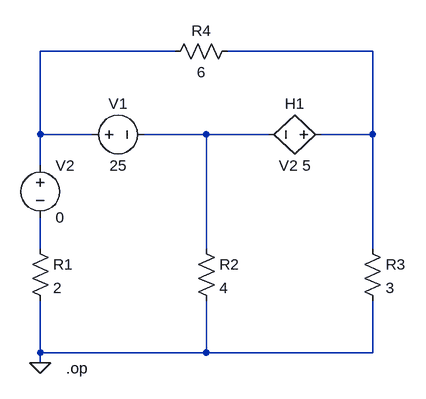
[diagram p0: schematic CH03-KP2-04.asc]
CH03-KP2-04.asc, the LTspice schematic file:
Version 4
SHEET 1 880 680
WIRE 256 48 48 48
WIRE 560 48 336 48
WIRE 48 176 48 48
WIRE 128 176 48 176
WIRE 304 176 208 176
WIRE 400 176 304 176
WIRE 560 176 560 48
WIRE 560 176 480 176
WIRE 48 224 48 176
WIRE 48 352 48 304
WIRE 304 352 304 176
WIRE 560 352 560 176
WIRE 48 512 48 432
WIRE 304 512 304 432
WIRE 304 512 48 512
WIRE 560 512 560 432
WIRE 560 512 304 512
WIRE 48 528 48 512
FLAG 48 528 0
DATAFLAG 64 176 "$"
DATAFLAG 336 176 "$"
DATAFLAG 560 176 "$"
SYMBOL res 32 336 R0
SYMATTR InstName R1
SYMATTR Value 2
SYMBOL res 288 336 R0
SYMATTR InstName R2
SYMATTR Value 4
SYMBOL res 544 336 R0
SYMATTR InstName R3
SYMATTR Value 3
SYMBOL res 352 32 R90
WINDOW 0 0 56 VBottom 2
WINDOW 3 32 56 VTop 2
SYMATTR InstName R4
SYMATTR Value 6
SYMBOL voltage 112 176 R270
WINDOW 0 32 56 VTop 2
WINDOW 3 -32 56 VBottom 2
SYMATTR InstName V1
SYMATTR Value 25
SYMBOL voltage 48 208 R0
SYMATTR InstName V2
SYMATTR Value 0
SYMBOL h 496 176 R90
WINDOW 0 -32 56 VBottom 2
WINDOW 3 32 56 VTop 2
SYMATTR InstName H1
SYMATTR Value V2 5
TEXT 88 536 Left 2 !.op

The netlist it stands for:
* CH03-KP2-04.asc
R1 N004 0 2
R2 N003 0 4
R3 N002 0 3
R4 N002 N001 6
V1 N001 N003 25
V2 N001 N004 0
H1 N002 N003 V2 5
.op
.backanno
.end